# EAGLE design AD725_video_encoder (EAGLE 6.3)
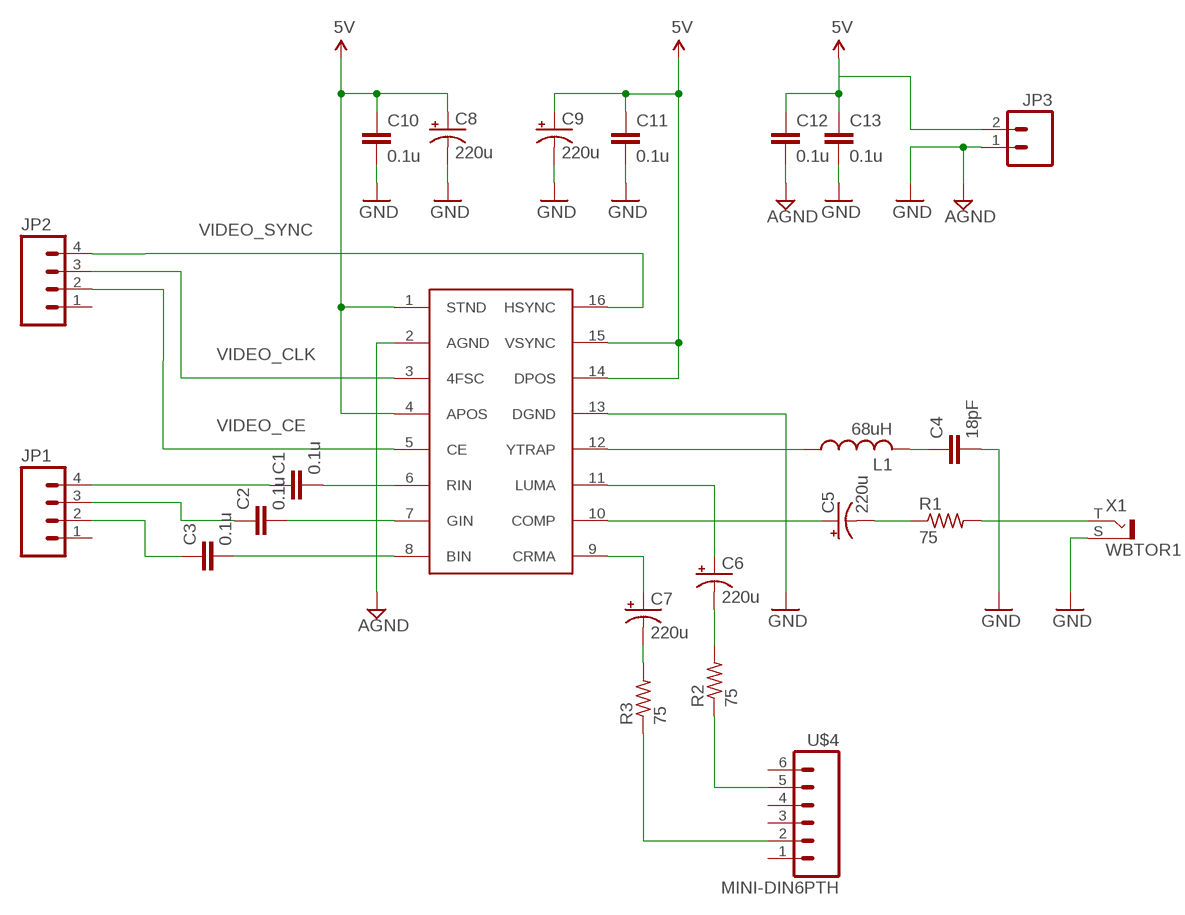
[diagram p0: schematic, sheet 1]

## Parts
C1  0.1u  CAPKIT  [CAP-PTH-SMALL-KIT]
C2  0.1u  CAPKIT  [CAP-PTH-SMALL-KIT]
C3  0.1u  CAPKIT  [CAP-PTH-SMALL-KIT]
C4  18pF  CAPKIT  [CAP-PTH-SMALL-KIT]
C5  220u  CPOL-USE2-4  [E2-4]
C6  220u  CPOL-USE2-4  [E2-4]
C7  220u  CPOL-USE2-4  [E2-4]
C8  220u  CPOL-USE2-4  [E2-4]
C9  220u  CPOL-USE2-4  [E2-4]
C10  0.1u  CAPKIT  [CAP-PTH-SMALL-KIT]
C11  0.1u  CAPKIT  [CAP-PTH-SMALL-KIT]
C12  0.1u  CAPKIT  [CAP-PTH-SMALL-KIT]
C13  0.1u  CAPKIT  [CAP-PTH-SMALL-KIT]
JP1  M04PTH  [1X04]
JP2  M04PTH  [1X04]
JP3  M02POLAR  [MOLEX-1X2]
L1  68uH  L-US0207/2V  [0207/2V]
R1  75  R-US_0204/5  [0204/5]
R2  75  R-US_0204/5  [0204/5]
R3  75  R-US_0204/5  [0204/5]
U$1  AD725  [SO16W]
U$4  MINI-DIN6PTH  [MINI-DIN6]
X1  WBTOR1  [WBTOR1]

## Nets
5V: C8.+ C9.+ C10.1 C11.1 C12.1 C13.1 JP3.2 U$1.1(STND) U$1.4(APOS) U$1.14(DPOS) U$1.15(VSYNC)
AGND: C12.2 U$1.2(AGND)
GND: C4.2 C8.- C9.- C10.2 C11.2 C13.2 JP3.1 U$1.13(DGND) X1.S ; supply symbol labelled AGND
N$1: C1.2 U$1.6(RIN)
N$2: C2.2 U$1.7(GIN)
N$3: C3.2 U$1.8(BIN)
N$4: C3.1 JP1.2
N$5: C2.1 JP1.3
N$6: C1.1 JP1.4
N$7: C7.- R3.2
N$8: C6.- R2.2
N$9: L1.1 U$1.12(YTRAP)
N$10: C4.1 L1.2
N$11: C5.+ U$1.10(COMP)
N$12: C5.- R1.1
N$13: C7.+ U$1.9(CRMA)
N$14: R1.2 X1.T
N$15: C6.+ U$1.11(LUMA)
N$16: R3.1 U$4.2
N$17: R2.1 U$4.5
VIDEO_CE: JP2.2 U$1.5(CE)
VIDEO_CLK: JP2.3 U$1.3(4FSC)
VIDEO_SYNC: JP2.4 U$1.16(HSYNC)
Unconnected: JP1.1 JP2.1 U$4.1 U$4.3 U$4.4 U$4.6

## Library data of the parts
C1-C4 C10-C13 = SparkFun:CAP: Capacitor Standard 0603 ceramic capacitor, and 0.1" leaded capacitor.
C5-C9 = rcl:CPOL-US: POLARIZED CAPACITOR, American symbol
JP1 JP2 = SparkFun:M04: Header 4 Standard 4-pin 0.1" header. Use with straight break away headers (SKU : PRT-00116), right angle break away headers (PRT-00553), swiss pins (PRT-00743), machine pins (PRT-00117), and female headers (PRT-00115). Molex polarized connector foot print use with SKU : PRT-08231 with associated crimp pins and housings. 1MM SMD Version SKU: PRT-10208
JP3 = SparkFun:M02: Header 2 Standard 2-pin 0.1" header. Use with straight break away headers (SKU : PRT-00116), right angle break away headers (PRT-00553), swiss pins (PRT-00743), machine pins (PRT-00117), and female headers (PRT-00115). Molex polarized connector foot print use with SKU : PRT-08233 with associated crimp pins and housings.
L1 = rcl:L-US: INDUCTOR, American symbol
R1-R3 = rcl:R-US_: RESISTOR, American symbol
U$1 = ad725:AD725
U$4 = SparkFun:MINI-DIN6: mini DIN 6 Connector Commonly found on the back of a computer for PS2 keyboard and mice. Schematic and footprint are proven. Spark Fun Electronics SKU : PRT-08509
X1 = con-lumberg:WBTOR1: RCA connectors according to JEITA RC-5231 Cinch RCA-Einbaukupplung nach JEITA RC-5231, abgewinkelte Ausführung Source: http://www.lumberg.de/Produkte/PDFs/WBTOR1.pdf; MPN: WBTOR 1 BLACK; OC_FARNELL: 1200146; OC_NEWARK: 98K2588

## Board
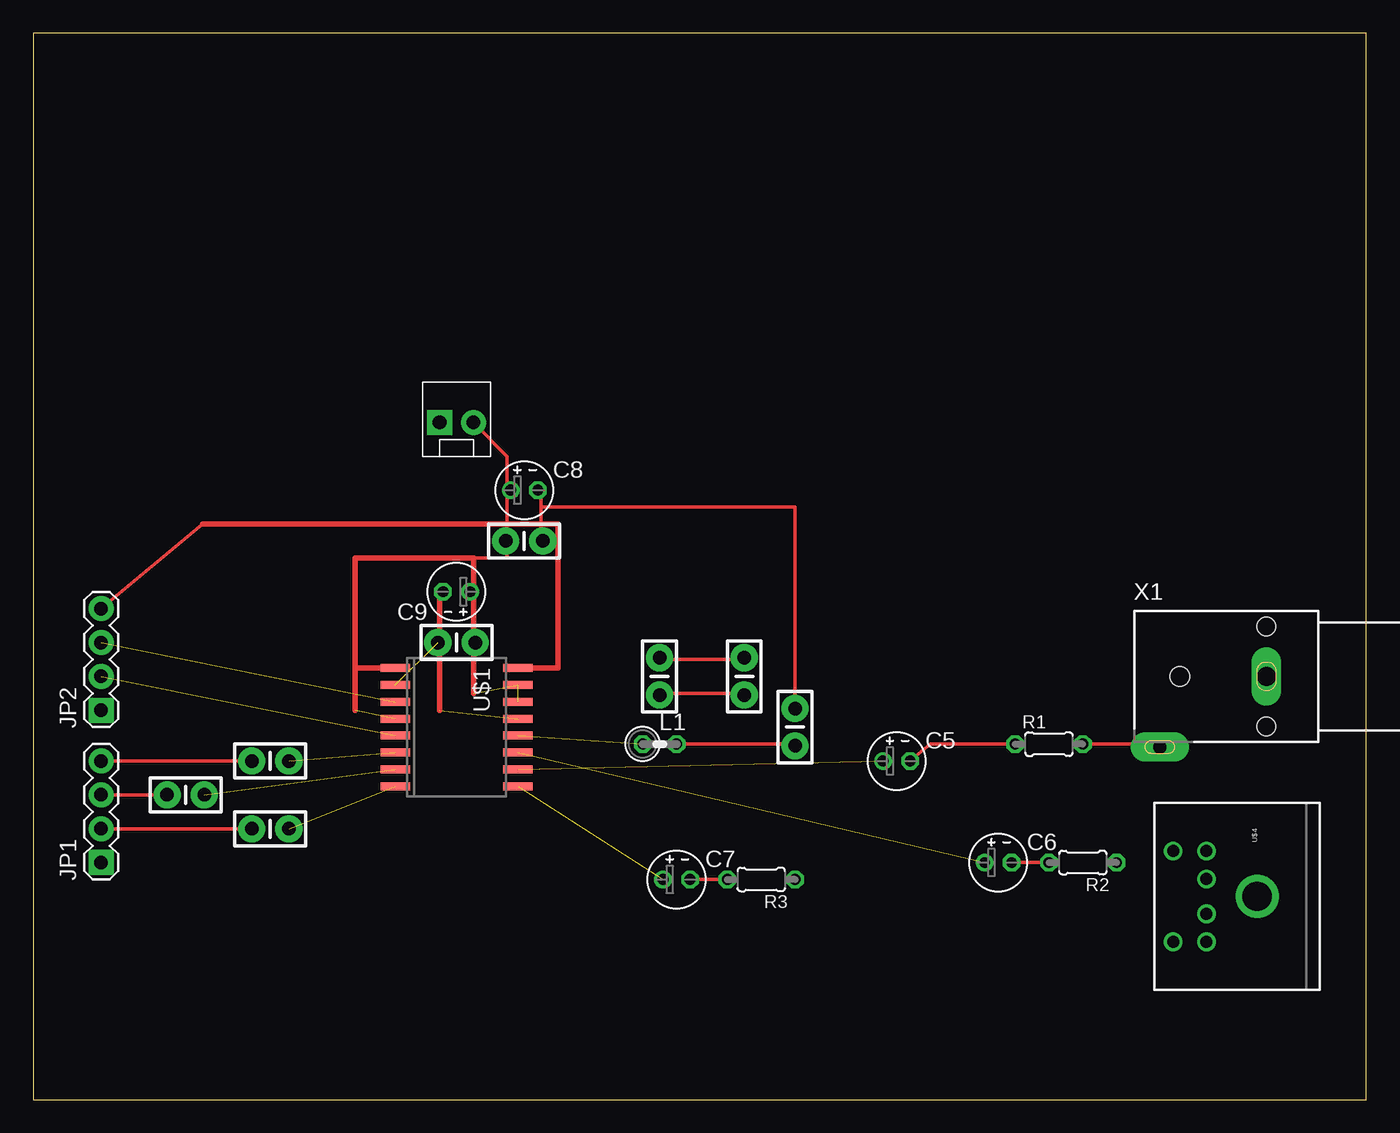
[diagram p1: board, top side]
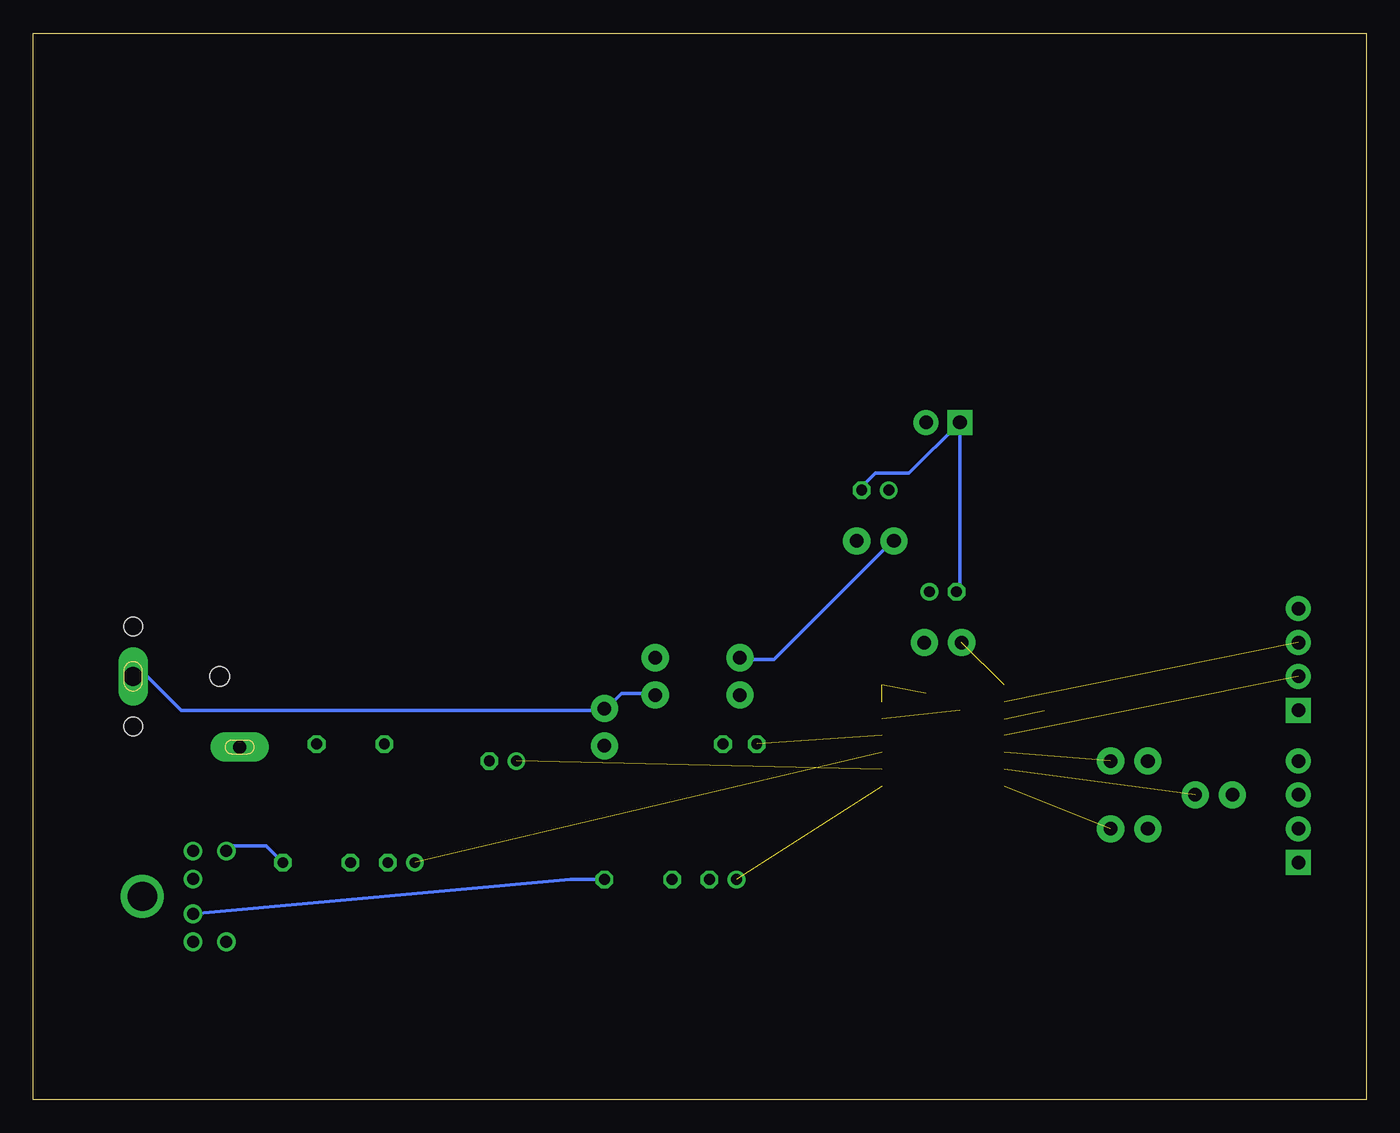
[diagram p2: board, bottom side, seen from below]

Size 100 x 80 mm. Coordinates in mm from the lower left corner, seen from the top.
Outline: 0,0 100,0 100,80 0,80 0,0
Copper layers (1*16): Top 0.035mm / dielectric 1.5mm / Bottom 0.035mm
Design rules "default": minimum track width 10mil, minimum drill 24mil, track to track 8mil, track to pad 8mil, pad to pad 8mil, via to via 8mil, smd to smd 8mil, copper to edge 40mil, drill to drill 8mil, minimum pad ring 10mil, minimum via ring 8mil, stop-mask expansion 4mil, vias tented up to drill 0mil, thermal gap 10mil

### Footprints (pad centres in the part's own frame; a part is rotated, then mirrored left to right if it is on the bottom)
CAP-PTH-SMALL-KIT = drill 1.016 pad 2.032: 1 -1.397,0; 2 1.397,0
E2-4 = drill 0.813 pad 1.27: + -1.016,0 | drill 0.813 pad 1.27 octagon: - 1.016,0
1X04 = drill 1.016 pad 1.88 square: 1 0,0 | drill 1.016 pad 1.88: 2 2.54,0; 3 5.08,0; 4 7.62,0
MOLEX-1X2 = drill 1.016 pad 1.88 square: 1 0,0 | drill 1.016 pad 1.88: 2 2.54,0
0207/2V = drill 0.813 octagon: 1 -1.27,0; 2 1.27,0
0204/5 = drill 0.813 octagon: 1 -2.54,0; 2 2.54,0
SO16W = smd 0.6 x 2.2: 1 -4.445,-4.6; 2 -3.175,-4.6; 3 -1.905,-4.6; 4 -0.635,-4.6; 5 0.635,-4.6; 6 1.905,-4.6; 7 3.175,-4.6; 8 4.445,-4.6; 9 4.445,4.6; 10 3.175,4.6; 11 1.905,4.6; 12 0.635,4.6; 13 -0.635,4.6; 14 -1.905,4.6; 15 -3.175,4.6; 16 -4.445,4.6
MINI-DIN6 = drill 0.9: 1 -1.3,-8.5; 2 1.3,-8.5; 3 -3.4,-8.5; 4 3.4,-8.5; 5 -3.4,-11; 6 3.4,-11 | drill 2.2: P$1 0,-4.7
WBTOR1 = drill 1.4 pad 2.2 long: S 0,-4 | drill 1 pad 2.2 long: T 5.3,-12 | hole 1.4: -3.75,-4; 3.75,-4 | hole 1.5: 0,-10.5

### Placement (x,y rotation side)
C1  17.78,25.4 0 top
C2  11.43,22.86 0 top
C3  17.78,20.32 0 top
C4  57.15,27.94 90 top
C5  64.77,25.4 0 top
C6  72.39,17.78 0 top
C7  48.26,16.51 0 top
C8  36.83,45.72 0 top
C9  31.75,38.1 180 top
C10  46.99,31.75 270 top
C11  36.83,41.91 0 top
C12  31.75,34.29 180 top
C13  53.34,31.75 270 top
JP1  5.08,17.78 90 top
JP2  5.08,29.21 90 top
JP3  30.48,50.8 0 top
L1  46.99,26.67 0 top
R1  76.2,26.67 0 top
R2  78.74,17.78 180 top
R3  54.61,16.51 180 top
U$1  31.75,27.94 270 top
U$4  96.52,15.24 270 top
X1  96.52,31.75 270 top

### Tracks (layer width: path | path; a pad name or v marks a point on that pad's centre or on a via)
5V  (3 unrouted)
  Top 0.254: 35.56,41.91 35.56,45.72 | 35.56,45.72 C8.+ 35.56,45.72 | 35.56,41.91 C11.1 35.56,41.91 | JP3.2 35.56,48.26 35.56,45.72 | 33.02,34.29 C12.1 | 33.02,40.64 35.56,40.64 35.56,41.91 | C10.1 46.99,33.02 53.34,33.02 C13.1
  Top 0.406: 33.02,38.1 C9.+ 33.02,38.1 | 33.02,38.1 33.02,34.29 33.02,30.48 | 33.02,38.1 33.02,40.64 24.13,40.64 24.13,33.02 | 24.13,33.02 24.13,29.21 | U$1.1 24.13,32.38 24.13,33.02
  Bottom 0.254: C11.1 35.56,41.91 44.45,33.02 46.99,33.02 C10.1
AGND  (1 unrouted)
GND  (1 unrouted)
  Top 0.254: 38.1,44.45 38.1,41.91 C11.2 | 38.1,44.45 38.1,45.72 C8.- | C10.2 46.99,30.48 53.34,30.48 C13.2 | 38.1,44.45 57.15,44.45 C4.2 | C4.2 57.15,29.21 C4.2
  Top 0.406: C9.- 30.48,38.1 30.48,29.21
  Bottom 0.254: C8.- 38.1,45.72 36.83,46.99 34.29,46.99 JP3.1 30.48,38.1 C9.- | 57.15,29.21 55.88,30.48 53.34,30.48 C13.2 | 57.15,29.21 C4.2 57.15,29.21 | 57.15,29.21 88.9,29.21 91.44,31.75 X1.S
N$1  (1 unrouted)
N$2  (1 unrouted)
N$3  (1 unrouted)
N$4
  Top 0.254: C3.1 16.51,20.32 C3.1 | C3.1 JP1.2
N$5
  Top 0.254: C2.1 10.16,22.86 C2.1 | C2.1 JP1.3
N$6
  Top 0.254: C1.1 16.51,25.4 C1.1 | C1.1 JP1.4
N$7
  Top 0.254: R3.2 49.53,16.51 C7.-
N$8
  Top 0.254: R2.2 73.66,17.78 C6.-
N$9  (1 unrouted)
N$10
  Top 0.254: L1.2 57.15,26.67 C4.1
N$11  (1 unrouted)
N$12
  Top 0.254: R1.1 67.31,26.67 C5.-
N$13  (1 unrouted)
N$14
  Top 0.254: R1.2 83.82,26.67 X1.T
N$15  (1 unrouted)
N$16
  Bottom 0.254: R3.1 59.69,16.51 87.63,13.97 U$4.2
N$17
  Bottom 0.254: R2.1 82.55,19.05 85.09,19.05 U$4.5
VIDEO_CE  (1 unrouted)
VIDEO_CLK  (1 unrouted)
VIDEO_SYNC
  Top 0.254: 12.7,43.18 JP2.4
  Top 0.406: U$1.16 39.37,32.38 39.37,43.18 12.7,43.18